# EAGLE schematic PCB-CMB-5-SHLD__testWDisp (EAGLE 6.5.0)

## Sheet 1 of 2
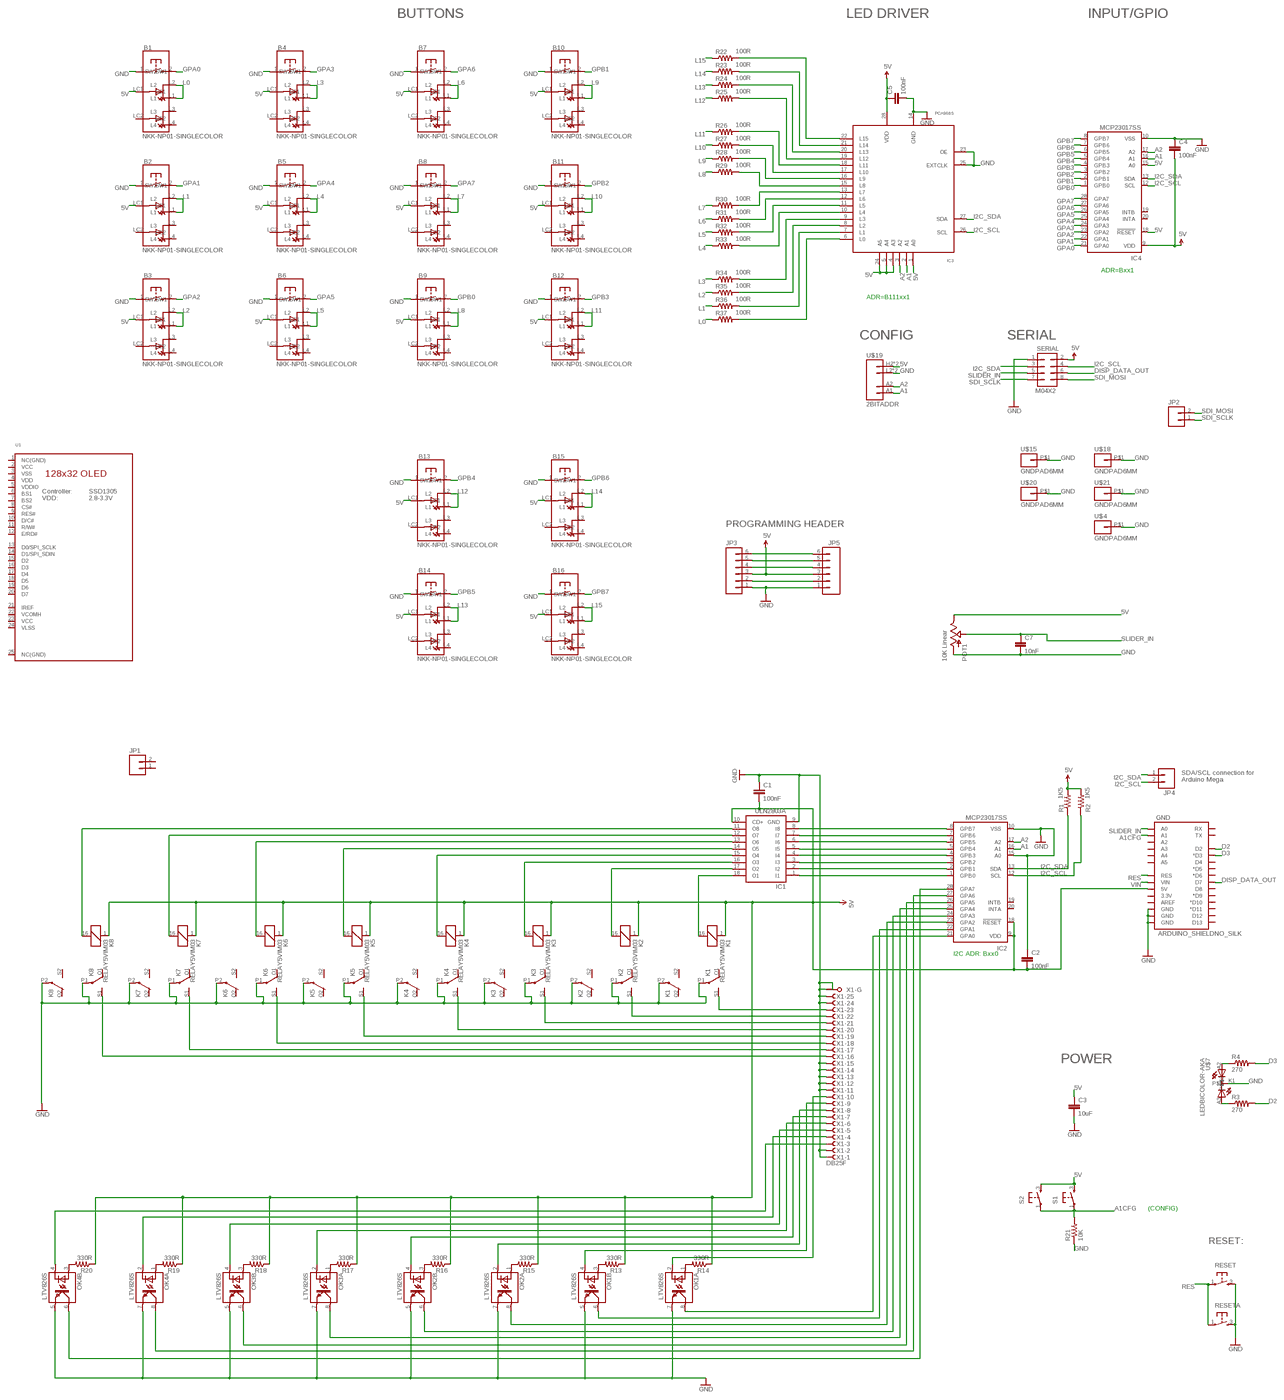
[diagram p0: schematic, sheet 1, overview]
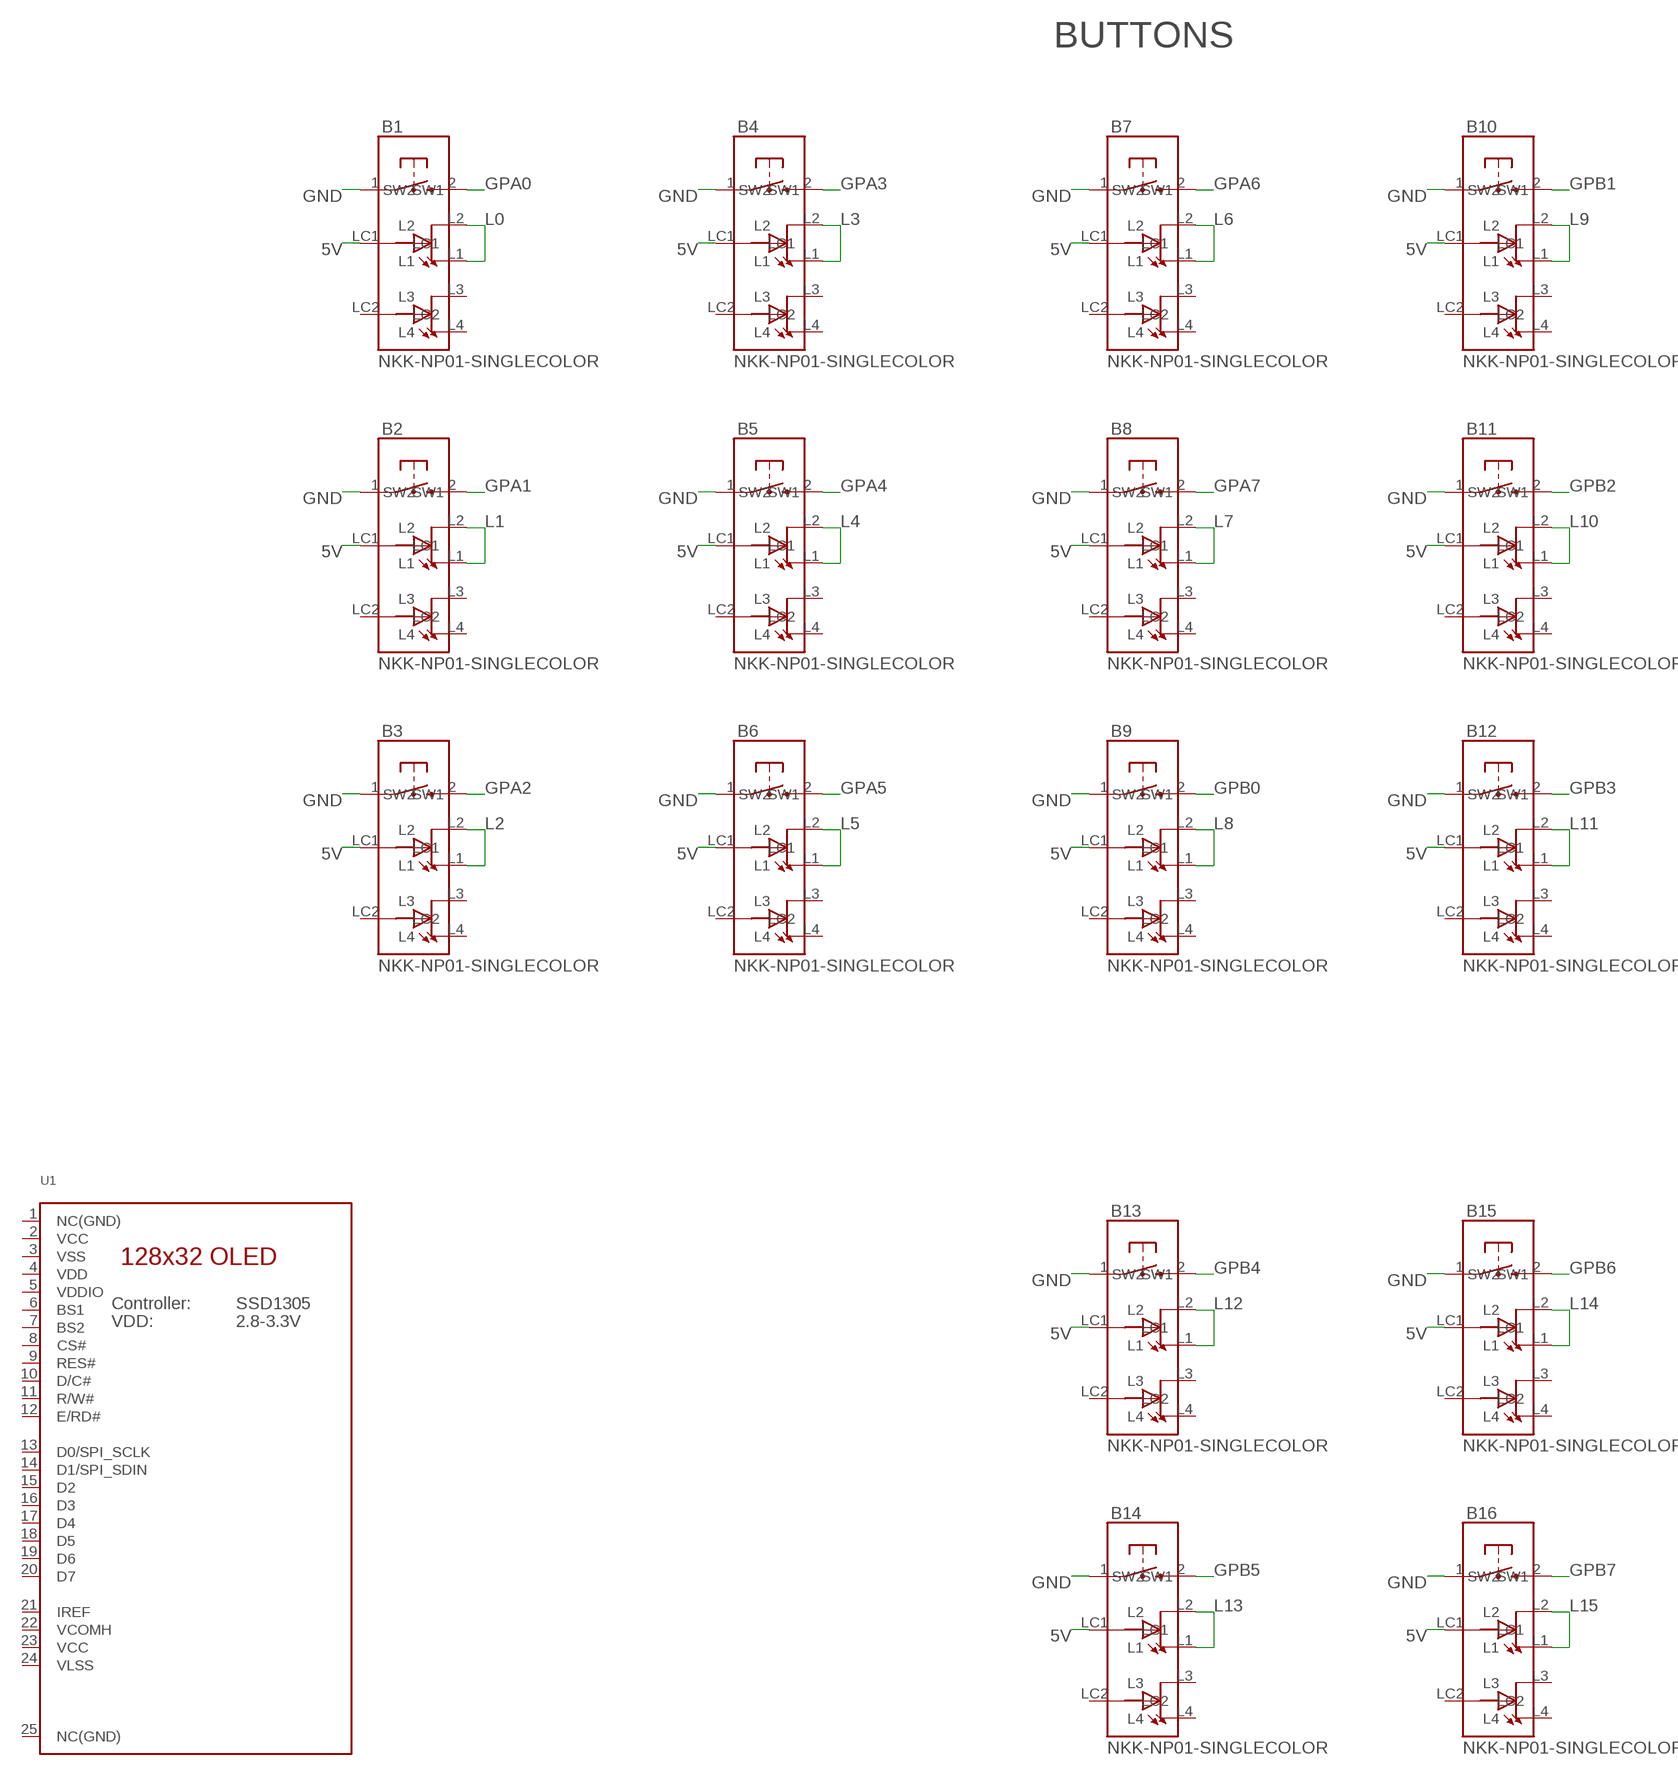
[diagram p1: schematic, sheet 1, part 1 of 4]
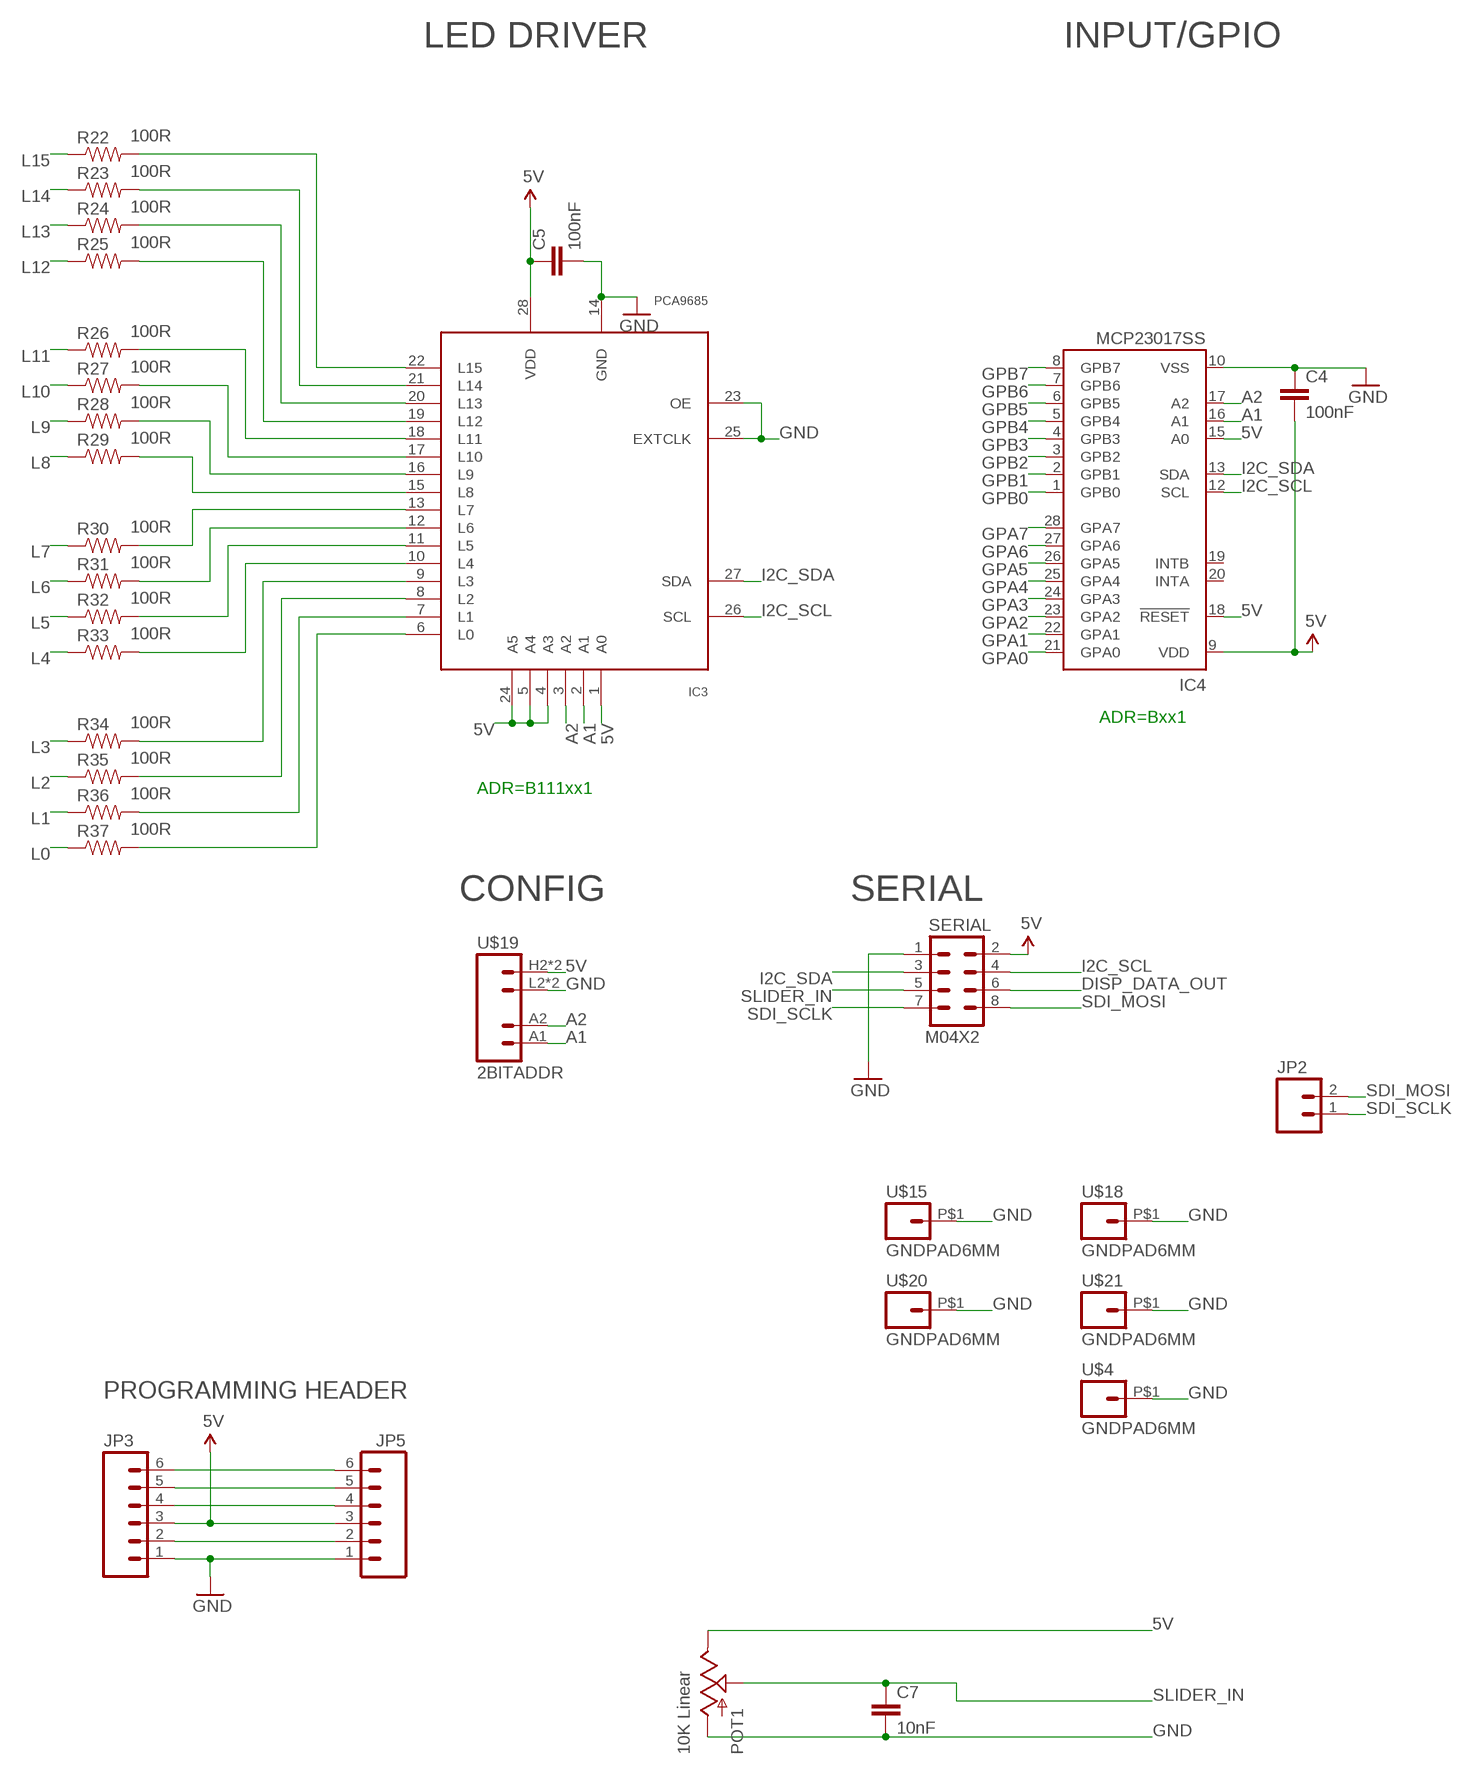
[diagram p2: schematic, sheet 1, part 2 of 4]
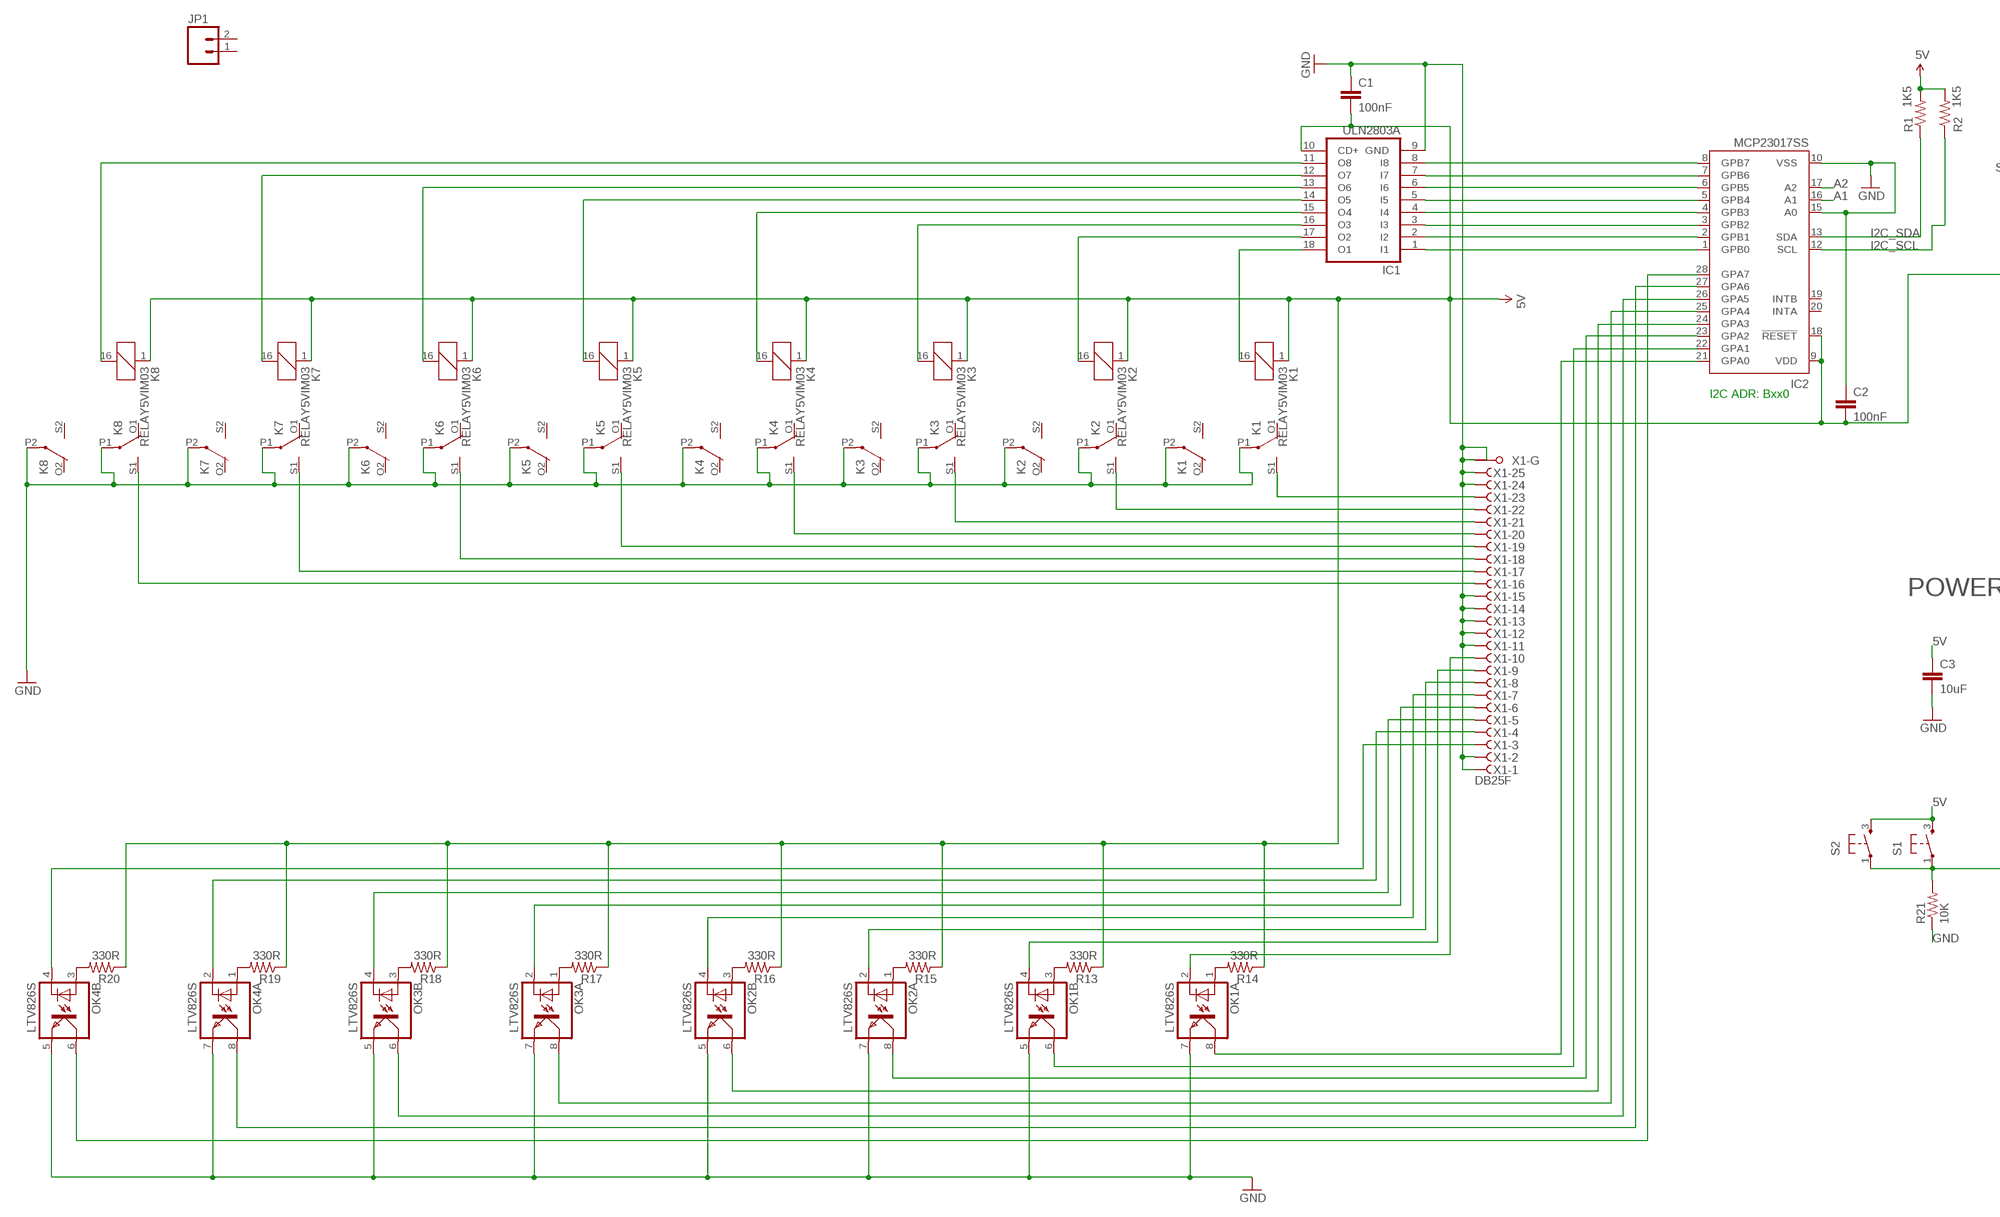
[diagram p3: schematic, sheet 1, part 3 of 4]
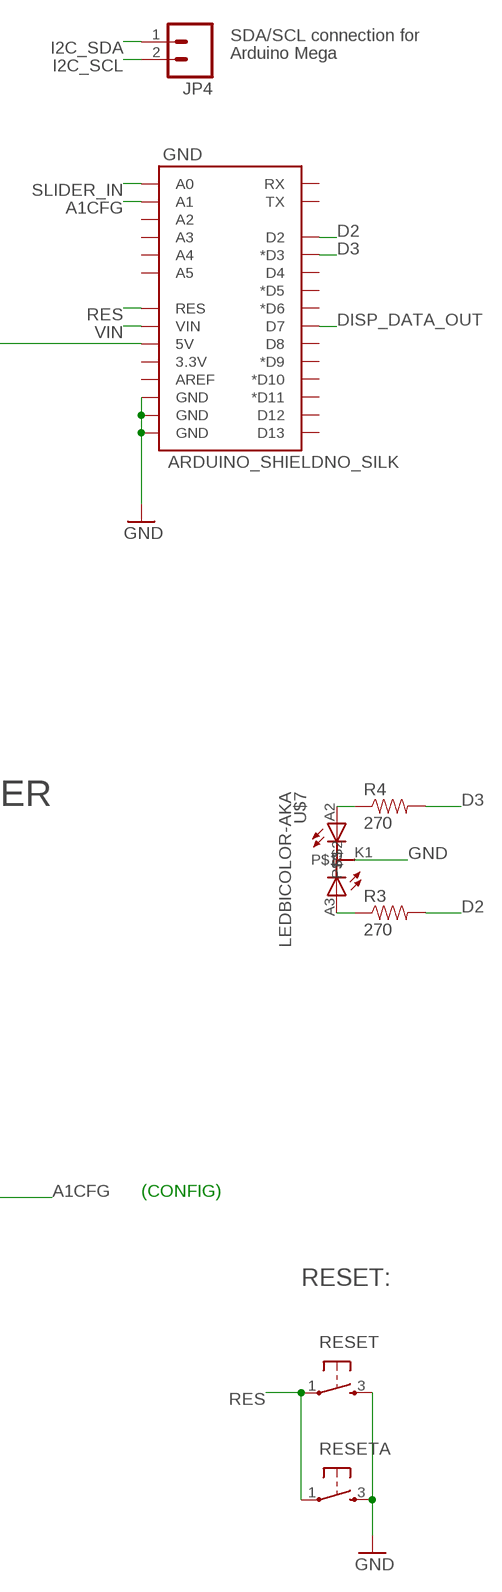
[diagram p4: schematic, sheet 1, part 4 of 4]

### Parts
B1  NKK-NP01-SINGLECOLOR  [NKK-NP01]
B2  NKK-NP01-SINGLECOLOR  [NKK-NP01]
B3  NKK-NP01-SINGLECOLOR  [NKK-NP01]
B4  NKK-NP01-SINGLECOLOR  [NKK-NP01]
B5  NKK-NP01-SINGLECOLOR  [NKK-NP01]
B6  NKK-NP01-SINGLECOLOR  [NKK-NP01]
B7  NKK-NP01-SINGLECOLOR  [NKK-NP01]
B8  NKK-NP01-SINGLECOLOR  [NKK-NP01]
B9  NKK-NP01-SINGLECOLOR  [NKK-NP01]
B10  NKK-NP01-SINGLECOLOR  [NKK-NP01]
B11  NKK-NP01-SINGLECOLOR  [NKK-NP01]
B12  NKK-NP01-SINGLECOLOR  [NKK-NP01]
B13  NKK-NP01-SINGLECOLOR  [NKK-NP01]
B14  NKK-NP01-SINGLECOLOR  [NKK-NP01]
B15  NKK-NP01-SINGLECOLOR  [NKK-NP01]
B16  NKK-NP01-SINGLECOLOR  [NKK-NP01]
C1  100nF  CAP0805  [0805]
C2  100nF  CAP0603-CAP  [0603-CAP]
C3  10uF  CAP0805  [0805]
C4  100nF  CAP0603-CAP  [0603-CAP]
C5  100nF  CAP0603-CAP  [0603-CAP]
C7  10nF  CAP0603-CAP  [0603-CAP]
GND  ARDUINO_SHIELDNO_SILK  [DUEMILANOVE_VIAS]
IC1  ULN2803A  ULN2803ASO18W  [SO18W]
IC2  MCP23017SS  [SSOP28]
IC3  PCA9685  [TSSOP28]
IC4  MCP23017SS  [SSOP28]
JP1  M02PTH  [1X02]
JP2  M02PTH  [1X02]
JP3  M06POLAR  [MOLEX-1X6]
JP4  M02PTH  [1X02]
JP5  M06POLAR  [MOLEX-1X6]
K1  RELAY5VIM03  [DS2Y]
K2  RELAY5VIM03  [DS2Y]
K3  RELAY5VIM03  [DS2Y]
K4  RELAY5VIM03  [DS2Y]
K5  RELAY5VIM03  [DS2Y]
K6  RELAY5VIM03  [DS2Y]
K7  RELAY5VIM03  [DS2Y]
K8  RELAY5VIM03  [DS2Y]
OK1  LTV826S  [DIL8-SMD]
OK2  LTV826S  [DIL8-SMD]
OK3  LTV826S  [DIL8-SMD]
OK4  LTV826S  [DIL8-SMD]
POT1  10K Linear  SLIDER20  [SLIDER20]
R1  1K5  RESISTOR0603-RES  [0603-RES]
R2  1K5  RESISTOR0603-RES  [0603-RES]
R3  270  RESISTOR0603-RES  [0603-RES]
R4  270  RESISTOR0603-RES  [0603-RES]
R13  330R  RESISTOR0603-RES  [0603-RES]
R14  330R  RESISTOR0603-RES  [0603-RES]
R15  330R  RESISTOR0603-RES  [0603-RES]
R16  330R  RESISTOR0603-RES  [0603-RES]
R17  330R  RESISTOR0603-RES  [0603-RES]
R18  330R  RESISTOR0603-RES  [0603-RES]
R19  330R  RESISTOR0603-RES  [0603-RES]
R20  330R  RESISTOR0603-RES  [0603-RES]
R21  10K  RESISTOR0603-RES  [0603-RES]
R22  100R  RESISTOR0603-RES  [0603-RES]
R23  100R  RESISTOR0603-RES  [0603-RES]
R24  100R  RESISTOR0603-RES  [0603-RES]
R25  100R  RESISTOR0603-RES  [0603-RES]
R26  100R  RESISTOR0603-RES  [0603-RES]
R27  100R  RESISTOR0603-RES  [0603-RES]
R28  100R  RESISTOR0603-RES  [0603-RES]
R29  100R  RESISTOR1206  [1206]
R30  100R  RESISTOR0603-RES  [0603-RES]
R31  100R  RESISTOR0603-RES  [0603-RES]
R32  100R  RESISTOR0603-RES  [0603-RES]
R33  100R  RESISTOR0603-RES  [0603-RES]
R34  100R  RESISTOR0603-RES  [0603-RES]
R35  100R  RESISTOR0603-RES  [0603-RES]
R36  100R  RESISTOR0603-RES  [0603-RES]
R37  100R  RESISTOR0603-RES  [0603-RES]
RESET  TAC_SWITCH  [PUSHBUTTON]
RESETA  TAC_SWITCH  [PUSHBUTTON]
S1  TAC_SWITCH  [PUSHBUTTON]
S2  TAC_SWITCH  [PUSHBUTTON]
SERIAL  M04X2  [2X4]
U1  ER-OLED0.91-2  [ER-OLED0.91-2_WRAPAROUND]
U$4  GNDPAD6MM  [3.2MMPAD6MM]
U$7  LEDBICOLOR-AKA  [LED5MM-BICOLOR]
U$15  GNDPAD6MM  [3.2MMPAD6MM]
U$18  GNDPAD6MM  [3.2MMPAD6MM]
U$19  2BITADDR  [2BITADDR]
U$20  GNDPAD6MM  [3.2MMPAD6MM]
U$21  GNDPAD6MM  [3.2MMPAD6MM]
X1  DB25F  F25HPS  [F25HP]

### Nets
5V [PWR]: B1.LC1 B2.LC1 B3.LC1 B4.LC1 B5.LC1 B6.LC1 B7.LC1 B8.LC1 B9.LC1 B10.LC1 B11.LC1 B12.LC1 B13.LC1 B14.LC1 B15.LC1 B16.LC1 C1.2 C2.2 C3.1 C4.2 C5.1 GND.5V IC1.10(CD+) IC2.9(VDD) IC2.18(!RESET) IC3.1(A0) IC3.4(A3) IC3.5(A4) IC3.24(A5) IC3.28(VDD) IC4.9(VDD) IC4.15(A0) IC4.18(!RESET) JP3.3 JP5.3 K1.1 K2.1 K3.1 K4.1 K5.1 K6.1 K7.1 K8.1 POT1.1(E) R1.2 R2.2 R13.1 R14.1 R15.1 R16.1 R17.1 R18.1 R19.1 R20.1 S1.3 S2.3 SERIAL.2 U$19.H2(VCC) U$19.H3(VCC)
A1: IC2.16(A1) IC3.2(A1) IC4.16(A1) U$19.A1
A1CFG: GND.A1 R21.2 S1.1 S2.1
A2: IC2.17(A2) IC3.3(A2) IC4.17(A2) U$19.A2
D2: GND.D2 R3.2
D3: GND.D3(*D3) R4.2
DISP_DATA_OUT: GND.D7 SERIAL.6
GND [PWR]: B1.1(SW1) B2.1(SW1) B3.1(SW1) B4.1(SW1) B5.1(SW1) B6.1(SW1) B7.1(SW1) B8.1(SW1) B9.1(SW1) B10.1(SW1) B11.1(SW1) B12.1(SW1) B13.1(SW1) B14.1(SW1) B15.1(SW1) B16.1(SW1) C1.1 C2.1 C3.2 C4.1 C5.2 C7.2 GND.GND@0(GND) GND.GND@1(GND) GND.GND@2(GND) IC1.9(GND) IC2.10(VSS) IC2.15(A0) IC3.14(GND) IC3.23(OE) IC3.25(EXTCLK) IC4.10(VSS) JP3.1 JP5.1 K1.P1(2:P) K1.P2(3:P) K2.P1(2:P) K2.P2(3:P) K3.P1(2:P) K3.P2(3:P) K4.P1(2:P) K4.P2(3:P) K5.P1(2:P) K5.P2(3:P) K6.P1(2:P) K6.P2(3:P) K7.P1(2:P) K7.P2(3:P) K8.P1(2:P) K8.P2(3:P) OK1.5(B:EMIT) OK1.7(A:EMIT) OK2.5(B:EMIT) OK2.7(A:EMIT) OK3.5(B:EMIT) OK3.7(A:EMIT) OK4.5(B:EMIT) OK4.7(A:EMIT) POT1.3(A) R21.1 RESET.3 RESETA.3 SERIAL.1 U$4.P$1 U$7.K1 U$15.P$1 U$18.P$1 U$19.L2(GND) U$19.L3(GND) U$20.P$1 U$21.P$1 X1.1(-1:F) X1.2(-2:F) X1.11(-11:F) X1.12(-12:F) X1.13(-13:F) X1.14(-14:F) X1.15(-15:F) X1.24(-24:F) X1.25(-25:F) X1.G1(-G:G1) X1.G2(-G:G2)
GPA0: B1.2(SW2) IC4.21(GPA0)
GPA1: B2.2(SW2) IC4.22(GPA1)
GPA2: B3.2(SW2) IC4.23(GPA2)
GPA3: B4.2(SW2) IC4.24(GPA3)
GPA4: B5.2(SW2) IC4.25(GPA4)
GPA5: B6.2(SW2) IC4.26(GPA5)
GPA6: B7.2(SW2) IC4.27(GPA6)
GPA7: B8.2(SW2) IC4.28(GPA7)
GPB0 [PWR]: B9.2(SW2) IC4.1(GPB0)
GPB1: B10.2(SW2) IC4.2(GPB1)
GPB2: B11.2(SW2) IC4.3(GPB2)
GPB3: B12.2(SW2) IC4.4(GPB3)
GPB4: B13.2(SW2) IC4.5(GPB4)
GPB5: B14.2(SW2) IC4.6(GPB5)
GPB6: B15.2(SW2) IC4.7(GPB6)
GPB7: B16.2(SW2) IC4.8(GPB7)
I2C_SCL: IC2.12(SCL) IC3.26(SCL) IC4.12(SCL) JP4.2 R2.1 SERIAL.4
I2C_SDA: IC2.13(SDA) IC3.27(SDA) IC4.13(SDA) JP4.1 R1.1 SERIAL.3
L0: B1.L1 B1.L2 R37.1
L1: B2.L1 B2.L2 R36.1
L2: B3.L1 B3.L2 R35.1
L3: B4.L1 B4.L2 R34.1
L4: B5.L1 B5.L2 R33.1
L5: B6.L1 B6.L2 R32.1
L6: B7.L1 B7.L2 R31.1
L7: B8.L1 B8.L2 R30.1
L8: B9.L1 B9.L2 R29.1
L9: B10.L1 B10.L2 R28.1
L10: B11.L1 B11.L2 R27.1
L11: B12.L1 B12.L2 R26.1
L12: B13.L1 B13.L2 R25.1
L13: B14.L1 B14.L2 R24.1
L14: B15.L1 B15.L2 R23.1
L15: B16.L1 B16.L2 R22.1
N$1 [RELAY LINES]: K1.S1(2:S) X1.23(-23:F)
N$2: IC3.13(L7) R30.2
N$3: JP3.4 JP5.4
N$4: IC1.18(O1) K1.16
N$5: IC1.1(I1) IC2.1(GPB0)
N$6 [RELAY LINES]: K2.S1(2:S) X1.22(-22:F)
N$7: R4.1 U$7.A2
N$8: JP3.5 JP5.5
N$9: IC1.17(O2) K2.16
N$10 [RELAY LINES]: K3.S1(2:S) X1.21(-21:F)
N$11: R3.1 U$7.A3
N$12: JP3.2 JP5.2
N$13: IC1.16(O3) K3.16
N$14 [RELAY LINES]: K4.S1(2:S) X1.20(-20:F)
N$17: IC1.15(O4) K4.16
N$18 [RELAY LINES]: K5.S1(2:S) X1.19(-19:F)
N$19: IC3.12(L6) R31.2
N$21: IC1.14(O5) K5.16
N$22 [RELAY LINES]: K6.S1(2:S) X1.18(-18:F)
N$23: IC3.11(L5) R32.2
N$25: IC1.13(O6) K6.16
N$26 [RELAY LINES]: K7.S1(2:S) X1.17(-17:F)
N$29: IC1.12(O7) K7.16
N$30 [RELAY LINES]: K8.S1(2:S) X1.16(-16:F)
N$31: IC3.10(L4) R33.2
N$33: IC1.11(O8) K8.16
N$34: IC1.2(I2) IC2.2(GPB1)
N$35: IC1.3(I3) IC2.3(GPB2)
N$36: IC1.4(I4) IC2.4(GPB3)
N$37: IC1.5(I5) IC2.5(GPB4)
N$38: IC1.6(I6) IC2.6(GPB5)
N$39: IC1.7(I7) IC2.7(GPB6)
N$40: IC1.8(I8) IC2.8(GPB7)
N$45: JP3.6 JP5.6
N$47: OK1.3(B:A) R13.2
N$48: OK1.1(A:A) R14.2
N$49 [INput lines]: OK1.2(A:C) X1.10(-10:F)
N$50: OK2.1(A:A) R15.2
N$51: IC2.21(GPA0) OK1.8(A:COL)
N$52: OK2.3(B:A) R16.2
N$53: OK3.1(A:A) R17.2
N$54: OK3.3(B:A) R18.2
N$55 [INput lines]: OK3.2(A:C) X1.6(-6:F)
N$56: OK4.1(A:A) R19.2
N$57: OK4.3(B:A) R20.2
N$58: IC3.9(L3) R34.2
N$59: IC3.8(L2) R35.2
N$60 [INput lines]: OK1.4(B:C) X1.9(-9:F)
N$61 [INput lines]: OK2.2(A:C) X1.8(-8:F)
N$62 [INput lines]: OK2.4(B:C) X1.7(-7:F)
N$63: IC2.28(GPA7) OK4.6(B:COL)
N$64 [INput lines]: OK3.4(B:C) X1.5(-5:F)
N$65 [INput lines]: OK4.2(A:C) X1.4(-4:F)
N$66 [INput lines]: OK4.4(B:C) X1.3(-3:F)
N$67: IC3.7(L1) R36.2
N$68: IC2.22(GPA1) OK1.6(B:COL)
N$69: IC2.23(GPA2) OK2.8(A:COL)
N$70: IC2.24(GPA3) OK2.6(B:COL)
N$71: IC2.25(GPA4) OK3.8(A:COL)
N$72: IC2.26(GPA5) OK3.6(B:COL)
N$73: IC2.27(GPA6) OK4.8(A:COL)
N$74: IC3.6(L0) R37.2
N$75: IC3.15(L8) R29.2
N$76: IC3.16(L9) R28.2
N$77: IC3.17(L10) R27.2
N$78: IC3.18(L11) R26.2
N$79: IC3.19(L12) R25.2
N$80: IC3.20(L13) R24.2
N$81: IC3.21(L14) R23.2
N$82: IC3.22(L15) R22.2
RES: GND.RES RESET.1 RESETA.1
SDI_MOSI: JP2.2 SERIAL.8
SDI_SCLK: JP2.1 SERIAL.7
SLIDER_IN: C7.1 GND.A0 POT1.2A(S) SERIAL.5
VIN: GND.VIN
Unconnected: B1.L3 B1.L4 B1.LC2 B2.L3 B2.L4 B2.LC2 B3.L3 B3.L4 B3.LC2 B4.L3 B4.L4 B4.LC2 B5.L3 B5.L4 B5.LC2 B6.L3 B6.L4 B6.LC2 B7.L3 B7.L4 B7.LC2 B8.L3 B8.L4 B8.LC2 B9.L3 B9.L4 B9.LC2 B10.L3 B10.L4 B10.LC2 B11.L3 B11.L4 B11.LC2 B12.L3 B12.L4 B12.LC2 B13.L3 B13.L4 B13.LC2 B14.L3 B14.L4 B14.LC2 B15.L3 B15.L4 B15.LC2 B16.L3 B16.L4 B16.LC2 GND.3.3V GND.A2 GND.A3 GND.A4 GND.A5 GND.AREF GND.D4 GND.D5(*D5) GND.D6(*D6) GND.D8 GND.D9(*D9) GND.D10(*D10) GND.D11(*D11) GND.D12 GND.D13 GND.RX GND.TX IC2.19(INTB) IC2.20(INTA) IC4.19(INTB) IC4.20(INTA) JP1.1 JP1.2 K1.O1(2:O) K1.O2(3:O) K1.S2(3:S) K2.O1(2:O) K2.O2(3:O) K2.S2(3:S) K3.O1(2:O) K3.O2(3:O) K3.S2(3:S) K4.O1(2:O) K4.O2(3:O) K4.S2(3:S) K5.O1(2:O) K5.O2(3:O) K5.S2(3:S) K6.O1(2:O) K6.O2(3:O) K6.S2(3:S) K7.O1(2:O) K7.O2(3:O) K7.S2(3:S) K8.O1(2:O) K8.O2(3:O) K8.S2(3:S) U1.1(NC(GND)) U1.6(BS1) U1.7(BS2) U1.8(CS#) U1.9(RES#) U1.10(D/C#) U1.11(R/W#) U1.12(E/RD#) U1.13(D0/SPI_SCLK) U1.14(D1/SPI_SDIN) U1.15(D2) U1.16(D3) U1.17(D4) U1.18(D5) U1.19(D6) U1.20(D7) U1.21(IREF) U1.22(VCOMH) U1.25(NC(GND))

### Notes on the sheet
- BUTTONS | LED DRIVER | INPUT/GPIO
- ADR=Bxx1
- ADR=B111xx1
- CONFIG | SERIAL
- PROGRAMMING HEADER
- SDA/SCL connection for
- Arduino Mega
- I2C ADR: Bxx0
- POWER
- (CONFIG)
- RESET:

## Sheet 2 of 2

## Power pins joined to a net without a drawn wire
VCC: U1.2(VCC) U1.23(VCC)
VDD: U1.4(VDD)
VDDIO: U1.5(VDDIO)
VLSS: U1.24(VLSS)
VSS: U1.3(VSS)

## Library data of the parts
B1-B16 = SKAARHOJ:NKK-NP01-SINGLECOLOR
C1-C5 C7 = SparkFun:CAP: Capacitor Standard 0603 ceramic capacitor, and 0.1" leaded capacitor.
GND = SparkFun:ARDUINO_SHIELD
IC1 = uln-udn:ULN2803A: DRIVER ARRAY
IC2 IC4 = microchip:MCP23017: http://ww1.microchip.com/downloads/en/DeviceDoc/21952a.pdf Source: http://ww1.microchip.com/downloads/en/DeviceDoc/21952a.pdf; MF: MICROCHIP; MPN: MCP23017-E/SS; OC_FARNELL: 1467674; OC_NEWARK: 31K2960
IC3 = wsmith:PCA9685
JP1 JP2 JP4 = SparkFun:M02: Header 2 Standard 2-pin 0.1" header. Use with straight break away headers (SKU : PRT-00116), right angle break away headers (PRT-00553), swiss pins (PRT-00743), machine pins (PRT-00117), and female headers (PRT-00115). Molex polarized connector foot print use with SKU : PRT-08233 with associated crimp pins and housings.
JP3 JP5 = SparkFun:M06: Header 6 Standard 6-pin 0.1" header. Use with straight break away headers (SKU : PRT-00116), right angle break away headers (PRT-00553), swiss pins (PRT-00743), machine pins (PRT-00117), and female headers (PRT-00115). Molex polarized connector foot print use with SKU : PRT-08094 with associated crimp pins and housings. NOTES ON THE VARIANTS LOCK and LOCK_LONGPADS... This footprint was designed to help hold the alignment of a through-hole component (i.e. 6-pin header) while soldering it into place. You may notice that each hole has been shifted either up or down by 0.005 of an inch from it's more standard position (which is a perfectly straight line). This slight alteration caused the pins (the squares in the middle) to touch the edges of the holes. Because they are alternating, it causes a "brace" to hold the component in place. 0.005 has proven to be the perfect amount of "off-center" position when using our standard breakaway headers. Although looks a little odd when you look at the bare footprint, once you have a header in there, the alteration is very hard to notice. Also, if you push a header all the way into place, it is covered up entirely on the bottom side. This idea of altering the position of holes to aid alignment will be further integrated into the Sparkfun Library for other footprints. It can help hold any component with 3 or more connection pins.
K1-K8 = SKAARHOJ:RELAY5V: RELAY 2 x switch, AxiCom 150 mW 5V
OK1-OK4 = optocoupler:LTV826: OPTO COUPLER Source: LITEON, LTV816.pdf; OC_FARNELL: unknown; OC_NEWARK: unknown
POT1 = SKAARHOJ:SLIDER
R1-R4 R13-R37 = SparkFun:RESISTOR: Resistor Basic schematic elements and footprints for 0603, 1206, and PTH resistors.
RESET RESETA S1 S2 = SKAARHOJ:TAC_SWITCH: Momentary Switch Button commonly used for reset or general input. Spark Fun Electronics SKU : COM-00097
SERIAL = SparkFun:M04X2
U1 = SKAARHOJ:ER-OLED0.91-2: UG-2864HSWEG01 OLED display Both 1.3" and 0.96" models share the same FPC tab footprint, only the screen dimensions vary.
U$4 U$15 U$18 U$20 U$21 = SKAARHOJ:GNDPAD
U$7 = SKAARHOJ:LEDBICOLOR-AKA
U$19 = SKAARHOJ:2BITADDR
X1 = con-subd:F25HPS: SUB-D; OC_FARNELL: unknown; OC_NEWARK: unknown

## Net classes
0 default: width 0.203 mm, drill 0.406 mm, clearance 0.203 mm
1 PWR: width 0.406 mm, drill 0.61 mm, clearance 0.203 mm
2 RELAY LINES: width 0.305 mm, clearance 0.203 mm
3 INput lines: clearance 0.203 mm